# EAGLE design minimum system (EAGLE 9.6.0)
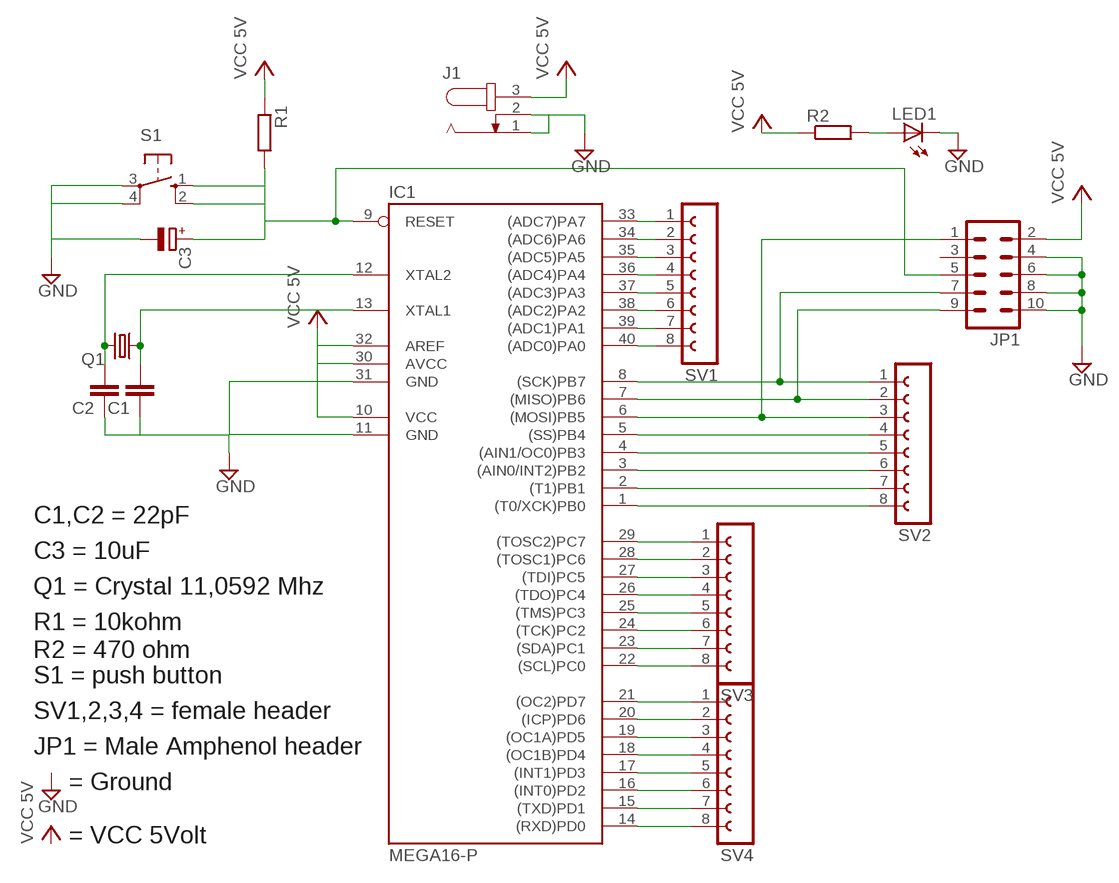
[diagram p0: schematic, sheet 1]

## Parts
C1  C2.5/2  [C2.5-2]
C2  C2.5/2  [C2.5-2]
C3  CPOL-EUE3.5-8  [E3,5-8]
IC1  MEGA16-P  [DIL40]
J1  JACK-PLUG0  [SPC4077]
JP1  ML10  [ML10]
LED1  LED5MM  [LED5MM]
Q1  CRYSTALHC49S  [HC49/S]
R1  R-EU_0207/10  [0207/10]
R2  R-EU_0207/10  [0207/10]
S1  10-XX  [B3F-10XX]
SV1  FE08-1  [FE08]
SV2  FE08-1  [FE08]
SV3  FE08-1  [FE08]
SV4  FE08-1  [FE08]

## Nets
GND: C1.1 C2.1 C3.- IC1.11(GND) IC1.31(GND) J1.1 J1.2 JP1.4 JP1.6 JP1.8 JP1.10 LED1.K(C) S1.3(P) S1.4(P1)
N$1: C2.2 IC1.12(XTAL2) Q1.2
N$2: C1.2 IC1.13(XTAL1) Q1.1
N$3: LED1.A R2.2
N$4: C3.+ R1.2 S1.1(S) S1.2(S1)
N$5: IC1.9(RESET) JP1.5
N$6: IC1.29((TOSC2)PC7) SV3.1
N$7: IC1.28((TOSC1)PC6) SV3.2
N$8: IC1.27((TDI)PC5) SV3.3
N$9: IC1.1((T0/XCK)PB0) SV2.8
N$10: IC1.40((ADC0)PA0) SV1.8
N$11: IC1.39((ADC1)PA1) SV1.7
N$12: IC1.38((ADC2)PA2) SV1.6
N$13: IC1.37((ADC3)PA3) SV1.5
N$14: IC1.36((ADC4)PA4) SV1.4
N$15: IC1.35((ADC5)PA5) SV1.3
N$16: IC1.34((ADC6)PA6) SV1.2
N$17: IC1.33((ADC7)PA7) SV1.1
N$18: IC1.2((T1)PB1) SV2.7
N$19: IC1.3((AIN0/INT2)PB2) SV2.6
N$20: IC1.4((AIN1/OC0)PB3) SV2.5
N$21: IC1.5((SS)PB4) SV2.4
N$22: IC1.6((MOSI)PB5) JP1.1 SV2.3
N$23: IC1.7((MISO)PB6) JP1.9 SV2.2
N$24: IC1.8((SCK)PB7) JP1.7 SV2.1
N$25: IC1.26((TDO)PC4) SV3.4
N$26: IC1.25((TMS)PC3) SV3.5
N$27: IC1.24((TCK)PC2) SV3.6
N$28: IC1.23((SDA)PC1) SV3.7
N$29: IC1.22((SCL)PC0) SV3.8
N$30: IC1.21((OC2)PD7) SV4.1
N$31: IC1.20((ICP)PD6) SV4.2
N$32: IC1.19((OC1A)PD5) SV4.3
N$33: IC1.18((OC1B)PD4) SV4.4
N$34: IC1.17((INT1)PD3) SV4.5
N$35: IC1.16((INT0)PD2) SV4.6
N$36: IC1.15((TXD)PD1) SV4.7
N$37: IC1.14((RXD)PD0) SV4.8
VCC: IC1.10(VCC) IC1.30(AVCC) IC1.32(AREF) J1.3 JP1.2 R1.1 R2.1 ; supply symbol labelled VCC 5V
Unconnected: JP1.3

## Notes on the sheet
- C1,C2 = 22pF
- C3 = 10uF
- Q1 = Crystal 11,0592 Mhz
- R1 = 10kohm
- R2 = 470 ohm
- S1 = push button
- SV1,2,3,4 = female header
- JP1 = Male Amphenol header
- = Ground
- = VCC 5Volt

## Library data of the parts
C1 C2 = capacitor-wima:C: CAPACITOR naming: grid - package width
C3 = rcl:CPOL-EU: POLARIZED CAPACITOR, European symbol
IC1 = atmel:MEGA16-P: MICROCONTROLLER 16 Kbytes FLASH 1 kbytes SRAM 512 bytes EEPROM USART 8-channel 10 bit ADC Source: avr.lbr
J1 = con-jack:JACK-PLUG: DC POWER JACK Power Jack, DC, Right Angle, Through Hole, Rated 5A at 16VDC, PC Terminals Distributor: Farnell (www.Farnell.de) Drawing: 84N1161.pdf / 84N1162.pdf Manufacturer: SPC Technology (www.spctechnology.com) Type: SPC4077 / SPC 4078
JP1 = con-harting-ml:ML10: HARTING
LED1 = led:LED: LED OSRAM: - CHIPLED LG R971, LG N971, LY N971, LG Q971, LY Q971, LO R971, LY R971 LH N974, LH R974 LS Q976, LO Q976, LY Q976 LO Q996 - Hyper CHIPLED LW Q18S LB Q993, LB Q99A, LB R99A - SideLED LS A670, LO A670, LY A670, LG A670, LP A670 LB A673, LV A673, LT A673, LW A673 LH A674 LY A675 LS A676, LA A676, LO A676, LY A676, LW A676 LS A679, LY A679, LG A679 - Hyper Micro SIDELED® LS Y876, LA Y876, LO Y876, LY Y876 LT Y87S - SmartLED LW L88C, LW L88S LB L89C, LB L89S, LG L890 LS L89K, LO L89K, LY L89K LS L896, LA L896, LO L896, LY L896 - TOPLED LS T670, LO T670, LY T670, LG T670, LP T670 LSG T670, LSP T670, LSY T670, LOP T670, LYG T670 LG T671, LOG T671, LSG T671 LB T673, LV T673, LT T673, LW T673 LH T674 LS T676, LA T676, LO T676, LY T676, LB T676, LH T676, LSB T676, LW T676 LB T67C, LV T67C, LT T67C, LS T67K, LO T67K, LY T67K, LW E67C LS E67B, LA E67B, LO E67B, LY E67B, LB E67C, LV E67C, LT E67C LW T67C LS T679, LY T679, LG T679 LS T770, LO T770, LY T770, LG T770, LP T770 LB T773, LV T773, LT T773, LW T773 LH T774 LS E675, LA E675, LY E675, LS T675 LS T776, LA T776, LO T776, LY T776, LB T776 LHGB T686 LT T68C, LB T68C - Hyper Mini TOPLED® LB M676 - Mini TOPLED Santana® LG M470 LS M47K, LO M47K, LY M47K Source: http://www.osram.convergy.de LUXEON: - LUMILED® LXK2-PW12-R00, LXK2-PW12-S00, LXK2-PW14-U00, LXK2-PW14-V00 LXK2-PM12-R00, LXK2-PM12-S00, LXK2-PM14-U00 LXK2-PE12-Q00, LXK2-PE12-R00, LXK2-PE12-S00, LXK2-PE14-T00, LXK2-PE14-U00 LXK2-PB12-K00, LXK2-PB12-L00, LXK2-PB12-M00, LXK2-PB14-N00, LXK2-PB14-P00, LXK2-PB14-Q00 LXK2-PR12-L00, LXK2-PR12-M00, LXK2-PR14-Q00, LXK2-PR14-R00 LXK2-PD12-Q00, LXK2-PD12-R00, LXK2-PD12-S00 LXK2-PH12-R00, LXK2-PH12-S00 LXK2-PL12-P00, LXK2-PL12-Q00, LXK2-PL12-R00 Source: www.luxeon.com KINGBRIGHT: KA-3528ASYC Source: www.kingbright.com
Q1 = crystal:CRYSTAL: CRYSTAL
R1 R2 = rcl:R-EU_: RESISTOR, European symbol
S1 = switch-omron:10-XX: OMRON SWITCH
SV1-SV4 = con-lsta:FE08-1: FEMALE HEADER

## Board
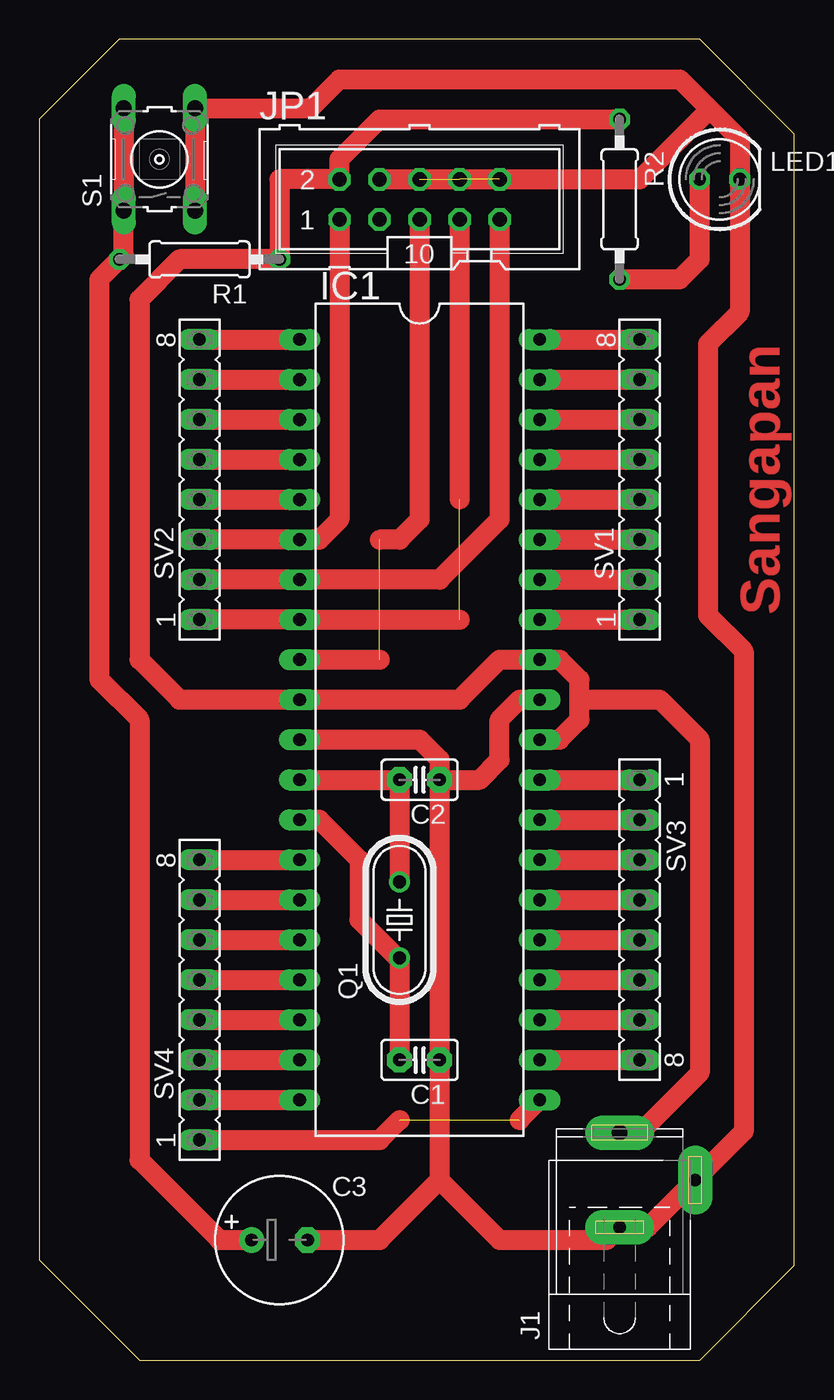
[diagram p1: board, top side]

Size 47.93 x 83.81 mm. Coordinates in mm from the lower left corner, seen from the top.
Outline: 0,78.74 0,6.35 6.35,0 41.91,0 47.93,6.02 47.93,77.8 41.92,83.81 5.07,83.81 0,78.74
Copper layers (1*16): Top 0.035mm / dielectric 1.5mm / Bottom 0.035mm
Design rules "default *": minimum track width 6mil, minimum drill 0.35mm, track to track 10mil, track to pad 10mil, pad to pad 10mil, via to via 10mil, smd to smd 10mil, copper to edge 50mil, drill to drill 6mil, minimum pad ring 10mil, minimum via ring 8mil, stop-mask expansion 10mil, vias tented up to drill 0mil, thermal gap 10mil

### Footprints (pad centres in the part's own frame; a part is rotated, then mirrored left to right if it is on the bottom)
C2.5-2 = drill 0.813 pad 1.6 octagon: 1 -1.27,0; 2 1.27,0
E3,5-8 = drill 0.813 pad 1.6: + -1.778,0 | drill 0.813 pad 1.6 octagon: - 1.778,0
DIL40 = drill 0.813 long: 1 -24.13,-7.62; 2 -21.59,-7.62; 3 -19.05,-7.62; 4 -16.51,-7.62; 5 -13.97,-7.62; 6 -11.43,-7.62; 7 -8.89,-7.62; 8 -6.35,-7.62; 9 -3.81,-7.62; 10 -1.27,-7.62; 11 1.27,-7.62; 12 3.81,-7.62; 13 6.35,-7.62; 14 8.89,-7.62; 15 11.43,-7.62; 16 13.97,-7.62; 17 16.51,-7.62; 18 19.05,-7.62; 19 21.59,-7.62; 20 24.13,-7.62; 21 24.13,7.62; 22 21.59,7.62; 23 19.05,7.62; 24 16.51,7.62; 25 13.97,7.62; 26 11.43,7.62; 27 8.89,7.62; 28 6.35,7.62; 29 3.81,7.62; 30 1.27,7.62; 31 -1.27,7.62; 32 -3.81,7.62; 33 -6.35,7.62; 34 -8.89,7.62; 35 -11.43,7.62; 36 -13.97,7.62; 37 -16.51,7.62; 38 -19.05,7.62; 39 -21.59,7.62; 40 -24.13,7.62
SPC4077 = drill 0.8 pad 2.184 long: 1 -3,0; 2 0,-4.8 | drill 1 pad 2.184 long: 3 3,0
ML10 = drill 0.914 octagon: 1 -5.08,-1.27; 2 -5.08,1.27; 3 -2.54,-1.27; 4 -2.54,1.27; 5 0,-1.27; 6 0,1.27; 7 2.54,-1.27; 8 2.54,1.27; 9 5.08,-1.27; 10 5.08,1.27
LED5MM = drill 0.813 octagon: A -1.27,0; K 1.27,0
HC49/S = drill 0.813: 1 -2.413,0; 2 2.413,0
0207/10 = drill 0.813 octagon: 1 -5.08,0; 2 5.08,0
B3F-10XX = drill 1.016 long: 1 -3.251,2.261; 2 3.251,2.261; 3 -3.251,-2.261; 4 3.251,-2.261
FE08 = drill 0.813 long: 1 -8.89,0; 2 -6.35,0; 3 -3.81,0; 4 -1.27,0; 5 1.27,0; 6 3.81,0; 7 6.35,0; 8 8.89,0

### Placement (x,y rotation side)
C1  24.13,19.05 180 top
C2  24.13,36.83 180 top
C3  15.24,7.62 0 top
IC1  24.13,40.64 270 top
J1  36.83,11.43 90 top
JP1  24.13,73.66 0 top
LED1  43.18,74.93 0 top
Q1  22.86,27.94 90 top
R1  10.16,69.85 180 top
R2  36.83,73.66 270 top
S1  7.62,76.2 90 top
SV1  38.1,55.88 90 top
SV2  10.16,55.88 90 top
SV3  38.1,27.94 270 top
SV4  10.16,22.86 90 top

### Tracks (layer width: path | path; a pad name or v marks a point on that pad's centre or on a via)
GND  (2 unrouted)
  Top 1.27: 42.55,79.38 44.45,77.47 LED1.K 44.45,66.51 42.44,64.5 42.44,47.26 44.7,45 44.7,14.5 J1.2 38.63,8.43 J1.1 | 42.55,79.38 40.64,81.28 19.05,81.28 17.22,79.45 S1.4 S1.3 | JP1.4 JP1.10 38.1,74.93 42.55,79.38 | C2.1 C1.1 25.4,11.43 | IC1.11 24.13,39.37 25.4,38.1 C2.1 | C2.1 27.94,36.83 29.21,38.1 29.21,40.64 30.48,41.91 IC1.31 | 36.37,8.89 J1.1 | C3.- 21.59,7.62 25.4,11.43 | 25.4,11.43 29.21,7.62 36.02,7.62 J1.1
N$1
  Top 1.27: IC1.12 C2.2 Q1.2
N$2
  Top 1.27: C1.2 Q1.1 22.73,25.53 20.32,27.94 20.32,31.75 17.78,34.29 IC1.13
N$3
  Top 1.27: R2.2 40.64,68.58 41.91,69.85 LED1.A
N$4
  Top 1.27: S1.2 S1.1 5.36,70.13 R1.2 3.81,68.58 3.81,43.18 6.35,40.64 6.35,12.7 11.43,7.62 C3.+
N$5  (1 unrouted)
  Top 1.27: JP1.5 24.13,53.34 22.86,52.07 21.59,52.07 | IC1.9 21.59,44.45
N$6
  Top 1.27: IC1.29 SV3.1
N$7
  Top 1.27: IC1.28 SV3.2
N$8
  Top 1.27: IC1.27 SV3.3
N$9
  Top 1.27: SV2.8 IC1.1
N$10
  Top 1.27: IC1.40 SV1.8
N$11
  Top 1.27: IC1.39 SV1.7
N$12
  Top 1.27: IC1.38 SV1.6
N$13
  Top 1.27: IC1.37 SV1.5
N$14
  Top 1.27: IC1.36 SV1.4
N$15
  Top 1.27: IC1.35 SV1.3
N$16
  Top 1.27: IC1.34 SV1.2
N$17
  Top 1.27: IC1.33 SV1.1
N$18
  Top 1.27: SV2.7 IC1.2
N$19
  Top 1.27: SV2.6 IC1.3
N$20
  Top 1.27: SV2.5 IC1.4
N$21
  Top 1.27: SV2.4 IC1.5
N$22
  Top 1.27: JP1.1 19.05,53.34 17.78,52.07 IC1.6 SV2.3
N$23
  Top 1.27: JP1.9 29.21,53.34 25.4,49.53 IC1.7 SV2.2
N$24  (1 unrouted)
  Top 1.27: SV2.1 IC1.8 26.67,46.99 | JP1.7 26.67,54.61
N$25
  Top 1.27: IC1.26 SV3.4
N$26
  Top 1.27: IC1.25 SV3.5
N$27
  Top 1.27: IC1.24 SV3.6
N$28
  Top 1.27: IC1.23 SV3.7
N$29
  Top 1.27: IC1.22 SV3.8
N$30  (1 unrouted)
  Top 1.27: SV4.1 21.59,13.97 22.86,15.24 | IC1.21 30.48,15.24
N$31
  Top 1.27: SV4.2 IC1.20
N$32
  Top 1.27: SV4.3 IC1.19
N$33
  Top 1.27: SV4.4 IC1.18
N$34
  Top 1.27: SV4.5 IC1.17
N$35
  Top 1.27: SV4.6 IC1.16
N$36
  Top 1.27: SV4.7 IC1.15
N$37
  Top 1.27: SV4.8 IC1.14
VCC
  Top 1.27: R2.1 21.59,78.74 19.05,76.2 JP1.2 15.24,74.93 R1.1 8.89,69.85 6.35,67.31 6.35,44.45 8.89,41.91 IC1.10 26.67,41.91 29.21,44.45 IC1.32 33.02,44.45 34.29,43.18 34.29,41.91 | J1.3 38.1,14.43 41.91,18.24 41.91,39.37 39.37,41.91 34.29,41.91 | IC1.30 33.02,39.37 34.29,40.64 34.29,41.91

### Text on the board
Top: Sangapan